# EAGLE design Bluetooth Control Car (EAGLE 9.6.2)
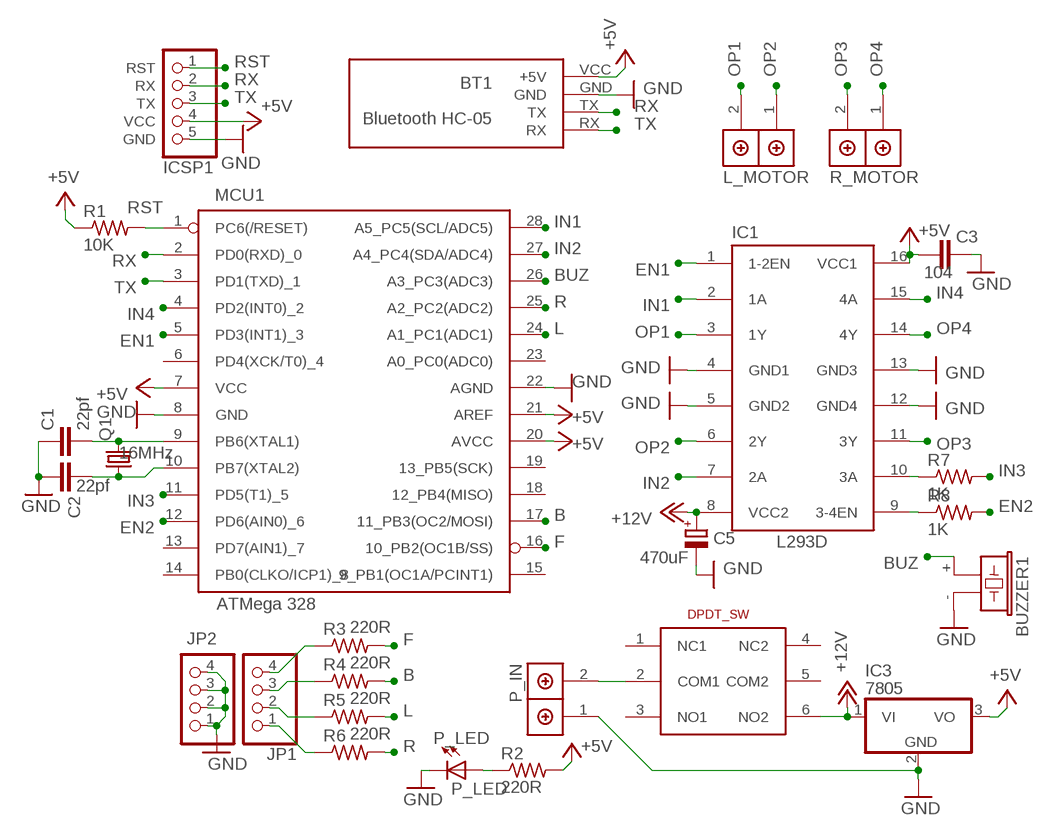
[diagram p0: schematic, sheet 1]

## Parts
BT1  Bluetooth HC-05  BLUETOOTH-HC-06-V3  [BLUETOOTH-HC-06-V3]
BUZZER1  F/CM12P  [F/CM12P]
C1  22pf  22PF  [22PF]
C2  22pf  22PF  [22PF]
C3  104  [104]
C5  470uF  CPOL-EUE5-10.5  [E5-10,5]
IC1  L293D  [DIL16]
IC3  7805  7805TV  [TO220V]
ICSP1  ICSP_ATMEGA328  [ICSP_ATMEGA]
JP1  PINHD-1X4  [1X04]
JP2  PINHD-1X4  [1X04]
L_MOTOR  2P  [2P]
MCU1  ATMega 328  ATMEGA328_P  [ATMEGA328_P]
P_IN  2P  [2P]
P_LED  P_LED  LED_3MM  [LED_3MM]
P_SW  P_SW  DPDT_SW  [6PIN_DPDT]
Q1  16MHz  CRYSTAL  [CRYSTAL]
R1  10K  RES204/7  [THR_R_204/7]
R2  220R  RES204/8  [THR_R_204/8]
R3  220R  RES204/7  [THR_R_204/7]
R4  220R  RES204/7  [THR_R_204/7]
R5  220R  RES204/7  [THR_R_204/7]
R6  220R  RES204/7  [THR_R_204/7]
R7  1K  RES204/7  [THR_R_204/7]
R8  1K  RES204/7  [THR_R_204/7]
R_MOTOR  2P  [2P]

## Nets
+5V: BT1.VCC(+5V) C3.1 IC1.16(VCC1) IC3.3(VO) ICSP1.4(VCC) MCU1.7(VCC) MCU1.20(AVCC) MCU1.21(AREF) R1.1 R2.2
+12V: C5.+ IC1.8(VCC2) IC3.1(VI) P_SW.6(NO2)
B: MCU1.17(11_PB3(OC2/MOSI)) R4.2
BUZ: BUZZER1.+ MCU1.26(A3_PC3(ADC3))
EN1: IC1.1(1-2EN) MCU1.5(PD3(INT1)_3)
EN2: MCU1.12(PD6(AIN0)_6) R8.2
F: MCU1.16(10_PB2(OC1B/SS)) R3.2
GND: BT1.GND BUZZER1.- C1.1 C2.2 C3.2 C5.- IC1.4(GND1) IC1.5(GND2) IC1.12(GND4) IC1.13(GND3) IC3.2(GND) ICSP1.5(GND) JP2.1 JP2.2 JP2.3 JP2.4 MCU1.8(GND) MCU1.22(AGND) P_IN.1(CONN1) P_LED.K
IN1: IC1.2(1A) MCU1.28(A5_PC5(SCL/ADC5))
IN2: IC1.7(2A) MCU1.27(A4_PC4(SDA/ADC4))
IN3: MCU1.11(PD5(T1)_5) R7.2
IN4: IC1.15(4A) MCU1.4(PD2(INT0)_2)
L: MCU1.24(A1_PC1(ADC1)) R5.2
N$1: C1.2 MCU1.9(PB6(XTAL1)) Q1.2
N$2: C2.1 MCU1.10(PB7(XTAL2)) Q1.1
N$3: JP1.4 R3.1
N$4: JP1.3 R4.1
N$5: P_LED.A R2.1
N$6: JP1.2 R5.1
N$7: P_IN.2(CONN2) P_SW.2(COM1)
N$8: JP1.1 R6.1
N$13: IC1.10(3A) R7.1
N$14: IC1.9(3-4EN) R8.1
OP1: IC1.3(1Y) L_MOTOR.2(CONN2)
OP2: IC1.6(2Y) L_MOTOR.1(CONN1)
OP3: IC1.11(3Y) R_MOTOR.2(CONN2)
OP4: IC1.14(4Y) R_MOTOR.1(CONN1)
R: MCU1.25(A2_PC2(ADC2)) R6.2
RST: ICSP1.1(RST) MCU1.1(PC6(/RESET)) R1.2
RX: BT1.TX ICSP1.2(RX) MCU1.2(PD0(RXD)_0)
TX: BT1.RX ICSP1.3(TX) MCU1.3(PD1(TXD)_1)
Unconnected: MCU1.6(PD4(XCK/T0)_4) MCU1.13(PD7(AIN1)_7) MCU1.14(PB0(CLKO/ICP1)_8) MCU1.15(9_PB1(OC1A/PCINT1)) MCU1.18(12_PB4(MISO)) MCU1.19(13_PB5(SCK)) MCU1.23(A0_PC0(ADC0)) P_SW.1(NC1) P_SW.3(NO1) P_SW.4(NC2) P_SW.5(COM2)

## Library data of the parts
BT1 = MHN_Modules:BLUETOOTH-HC-06-V3: Bluetooth Transceiver Module based on HC-05 board Tutorial is available here: https://arduino-info.wikispaces.com/BlueTooth-HC05-HC06-Modules-How-To Click here to find device on ebay.com <http://www.ebay.com/sch/hc-05+module+rs232>
BUZZER1 = MHN_Buzzer:F/CM12P: BUZZER Source: Buerklin; OC_FARNELL: unknown; OC_NEWARK: unknown
C1 C2 = MHN_Capacitor:22PF: (220)22pf Ceramic Capacitor
C3 = MHN_Capacitor:104: Ciramic Capacitor - 104/103/22/33 pf
C5 = rcl:CPOL-EU: POLARIZED CAPACITOR, European symbol; SPICEPREFIX: C
IC1 = st-microelectronics:L293D: PUSH-PULL 4 CHANNEL DRIVER; MPN: L293D; OC_FARNELL: 9589619; OC_NEWARK: 56P8249
IC3 = linear:78*: Positive VOLTAGE REGULATOR Source: http://cache.national.com/ds/LM/LM78L05.pdf http://www.fairchildsemi.com/ds/LM/LM7805.pdf
ICSP1 = MHN_ICSP_Header:ICSP_ATMEGA328
JP1 JP2 = pinhead:PINHD-1X4: PIN HEADER
L_MOTOR P_IN R_MOTOR = MHN_TBlock:2P: Green Terminal Block
MCU1 = MHN_IC_Microcontroller:ATMEGA328_P: Microcontroller with 32K Bytes In-System Programmable Flash
P_LED = MHN_LED:LED_3MM: LED 3mm
P_SW = MHN_Switch:DPDT_SW
Q1 = MHN_Crystal:CRYSTAL: CRYSTAL
R1-R8 = MHN_Resistor:RES

## Board
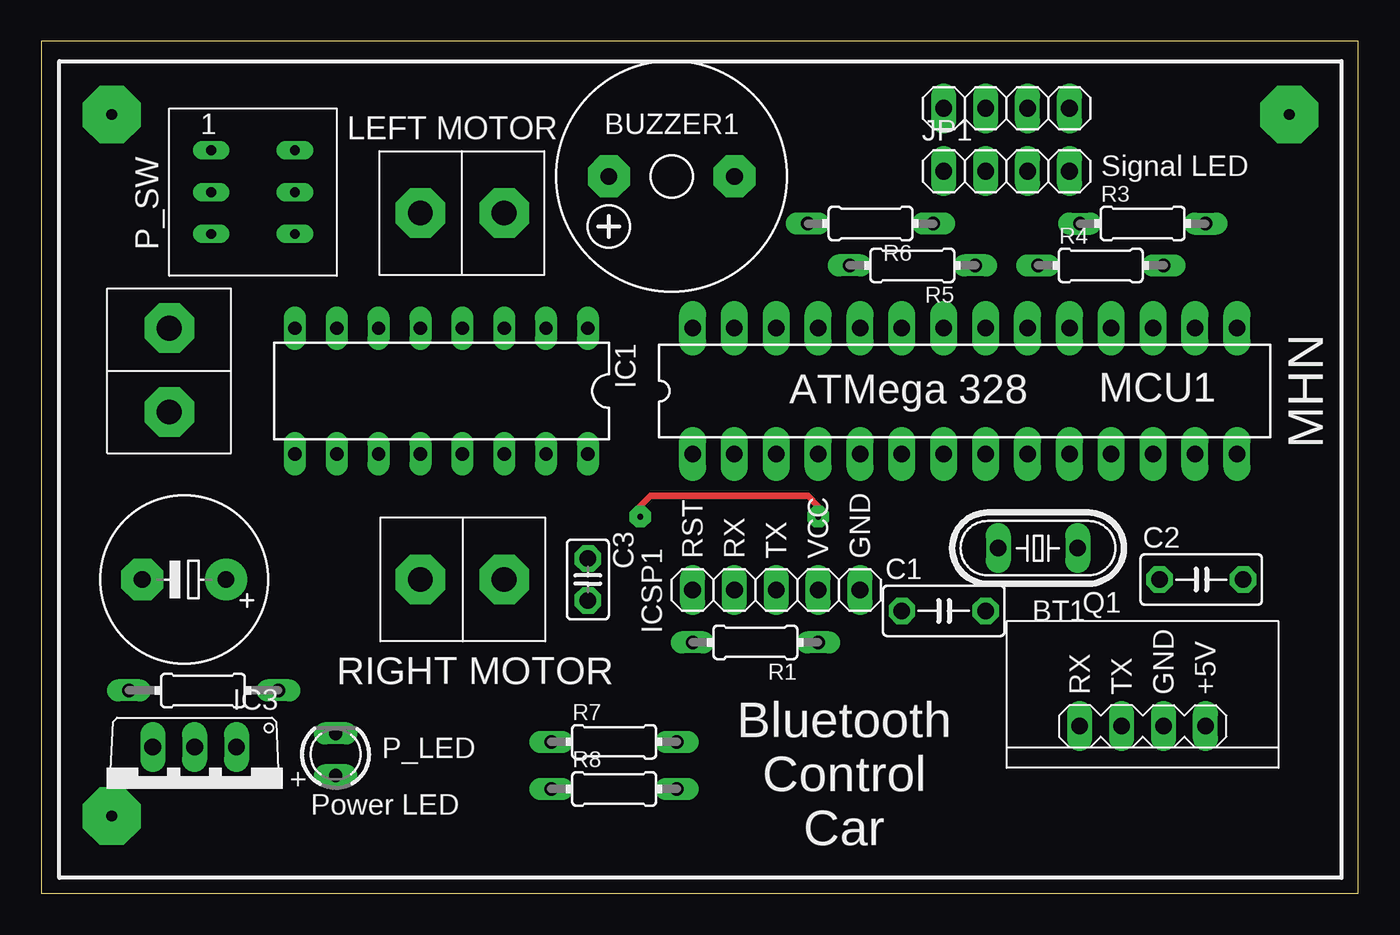
[diagram p1: board, top side]
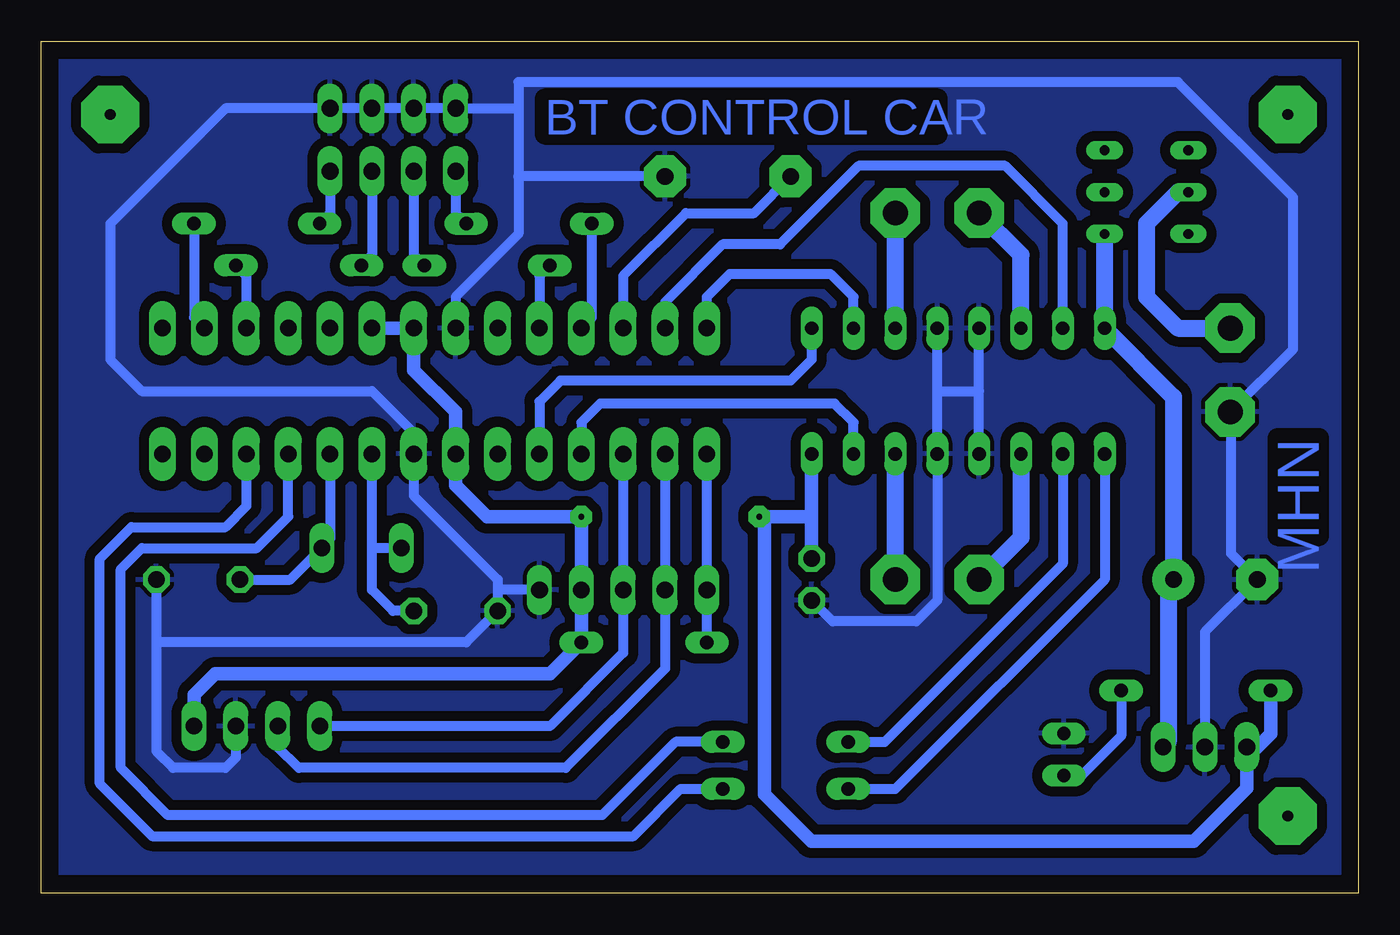
[diagram p2: board, bottom side, seen from below]

Size 79.91 x 51.68 mm. Coordinates in mm from the lower left corner, seen from the top.
Outline: 0,0 79.9,0 79.9,51.68 0,51.68 0,0
Copper layers (1*16): Top 0.035mm / dielectric 1.5mm / Bottom 0.035mm
Design rules "default": minimum track width 6mil, minimum drill 0.35mm, track to track 6mil, track to pad 6mil, pad to pad 6mil, via to via 6mil, smd to smd 6mil, copper to edge 40mil, drill to drill 6mil, minimum pad ring 10mil, minimum via ring 8mil, stop-mask expansion 4mil, vias tented up to drill 0mil, thermal gap 10mil

### Footprints (pad centres in the part's own frame; a part is rotated, then mirrored left to right if it is on the bottom)
BLUETOOTH-HC-06-V3 = drill 1 pad 1.5 long: GND 1.27,-4.445; RX -3.81,-4.445; TX -1.27,-4.445; VCC 3.81,-4.445
F/CM12P = drill 1.016 pad 2.54 octagon: + 3.81,0; - -3.81,0
22PF = drill 1 pad 1.6 octagon: 1 -2.54,0; 2 2.54,0
104 = drill 1 pad 1.6 octagon: 1 -1.27,0; 2 1.27,0
E5-10,5 = drill 1.016 pad 2.54: + -2.54,0 | drill 1.016 pad 2.54 octagon: - 2.54,0
DIL16 = drill 0.813 long: 1 -8.89,-3.81; 2 -6.35,-3.81; 3 -3.81,-3.81; 4 -1.27,-3.81; 5 1.27,-3.81; 6 3.81,-3.81; 7 6.35,-3.81; 8 8.89,-3.81; 9 8.89,3.81; 10 6.35,3.81; 11 3.81,3.81; 12 1.27,3.81; 13 -1.27,3.81; 14 -3.81,3.81; 15 -6.35,3.81; 16 -8.89,3.81
TO220V = drill 1.016 long: 1 -2.54,-2.54; 2 0,-2.54; 3 2.54,-2.54
ICSP_ATMEGA = drill 1.016 long: 1 -5.08,0; 2 -2.54,0; 3 0,0; 4 2.54,0; 5 5.08,0
1X04 = drill 1.016 long: 1 -3.81,0; 2 -1.27,0; 3 1.27,0; 4 3.81,0
2P = drill 1.5 pad 3 octagon: 1 -2.54,0; 2 2.54,0
ATMEGA328_P = drill 1 pad 1.65 long: 1 -7.62,-3.81; 2 -5.08,-3.81; 3 -2.54,-3.81; 4 0,-3.81; 5 2.54,-3.81; 6 5.08,-3.81; 7 7.62,-3.81; 8 10.16,-3.81; 9 12.7,-3.81; 10 15.24,-3.81; 11 17.78,-3.81; 12 20.32,-3.81; 13 22.86,-3.81; 14 25.4,-3.81; 15 25.4,3.81; 16 22.86,3.81; 17 20.32,3.81; 18 17.78,3.81; 19 15.24,3.81; 20 12.7,3.81; 21 10.16,3.81; 22 7.62,3.81; 23 5.08,3.81; 24 2.54,3.81; 25 0,3.81; 26 -2.54,3.81; 27 -5.08,3.81; 28 -7.62,3.81
LED_3MM = drill 0.813 long: A -1.27,0; K 1.27,0
6PIN_DPDT = drill 0.6 long: 1 -2.54,1.27; 2 -2.54,-1.27; 3 -2.54,-3.81; 4 2.54,1.27; 5 2.54,-1.27; 6 2.54,-3.81
CRYSTAL = drill 1 pad 1.5 long: 1 -2.413,0; 2 2.413,0
THR_R_204/7 = drill 0.813 long: 1 -3.81,0; 2 3.81,0
THR_R_204/8 = drill 0.813 long: 1 -3.81,0; 2 5.258,0

### Placement (x,y rotation side)
BT1  66.82,14.59 0 top
BUZZER1  38.25,43.48 180 top
C1  54.76,17.13 0 top
C2  70.38,19.04 0 top
C3  33.17,19.04 270 top
C5  8.67,19.04 180 top
IC1  24.28,30.47 180 top
IC3  9.31,6.34 180 top
ICSP1  44.6,18.4 0 top
JP1  58.57,43.8 0 top
JP2  58.57,47.61 0 top
L_MOTOR  25.55,41.26 0 top
MCU1  47.14,30.47 0 top
P_IN  7.77,31.74 90 top
P_LED  17.86,8.43 90 top
P_SW  12.85,43.8 0 top
Q1  60.47,20.94 180 top
R1  43.33,15.23 180 top
R2  10.58,12.31 180 top
R3  66.82,40.63 0 top
R4  64.28,38.09 0 top
R5  52.85,38.09 180 top
R6  50.31,40.63 180 top
R7  34.76,9.19 0 top
R8  34.76,6.34 0 top
R_MOTOR  25.55,19.04 180 top

### Tracks (layer width: path | path; a pad name or v marks a point on that pad's centre or on a via)
+5V  (via drill 0.35 pad 1.3)
  Top 0.406: v47.14,22.85 47.14,23.48 46.5,24.12 36.98,24.12 36.34,23.48 v36.34,22.85
  Bottom 0.813: BT1.VCC 70.63,12.05 69.36,13.32 49.04,13.32 R1.1 ICSP1.4 v47.14,22.85 52.85,22.85 54.76,24.75 MCU1.7 54.76,29.2 57.3,31.74 MCU1.21 MCU1.20 | IC1.16 33.17,22.85 | 33.17,22.85 C3.1 | 33.17,22.85 v36.34,22.85 36.03,22.53 36.03,6.02 33.17,3.16 9.99,3.16 6.77,6.39 IC3.3 6.13,8.88 5.32,9.69 R2.2
+12V
  Bottom 1.016: P_SW.6 IC1.8 11.21,30.1 C5.+ 11.53,18.72 11.53,9.19 IC3.1
B
  Bottom 0.61: R4.2 67.46,37.45 MCU1.17
BUZ
  Bottom 0.61: BUZZER1.+ 36.66,41.26 40.79,41.26 44.6,37.45 MCU1.26
EN1
  Bottom 0.61: IC1.1 33.17,32.37 34.44,31.1 48.41,31.1 49.68,29.83 MCU1.5
EN2
  Bottom 0.61: R8.2 41.1,6.34 43.96,3.48 73.17,3.48 76.35,6.65 76.35,20.31 74.44,22.21 68.73,22.21 67.46,23.48 MCU1.12
F
  Bottom 0.61: R3.2 70.63,34.91 MCU1.16
GND
  Bottom 0.61: 25.55,30.47 IC1.13 25.55,17.77 26.82,16.5 31.9,16.5 C3.2 | 25.55,30.47 IC1.4 | IC1.12 23.01,30.47 | 23.01,30.47 IC1.5 | 25.55,30.47 23.01,30.47 | 72.92,15.23 54.12,15.23 C1.1 52.22,18.4 | BT1.GND 68.09,8.24 68.73,7.61 71.9,7.61 72.92,8.62 C2.2 | 52.22,18.4 52.22,19.04 57.3,24.12 MCU1.8 57.3,27.93 59.84,30.47 73.81,30.47 75.71,32.37 75.71,40.63 68.73,47.61 JP2.4 JP2.3 JP2.2 JP2.1 50.95,47.61 | ICSP1.5 52.22,18.4 | MCU1.22 54.76,36.18 50.95,39.99 50.95,43.49 | 50.95,47.61 50.95,49.2 10.94,49.2 3.96,42.21 3.96,33.01 P_IN.1 7.72,29.15 7.72,20.62 C5.- 9.31,15.86 IC3.2 9.56,9.13 | 50.95,47.61 50.95,43.49 | BUZZER1.- 50.95,43.49
  pour Bottom (isolate 0.61): 78.89,1.26 78.89,50.47 1.1,50.47 1.1,1.26
IN1
  Bottom 0.61: IC1.2 30.63,36.18 32.02,37.58 38.12,37.58 39.52,36.18 MCU1.28
IN2
  Bottom 0.61: MCU1.27 42.06,35.86 38.57,39.36 35.07,39.36 30.31,44.12 21.42,44.12 17.93,40.63 IC1.7
IN3
  Bottom 0.61: MCU1.11 64.92,22.85 66.82,20.94 73.81,20.94 75.08,19.67 75.08,7.61 72.22,4.75 45.87,4.75 41.42,9.19 R7.2
IN4
  Bottom 0.61: IC1.15 30.63,28.56 31.77,29.71 45.99,29.71 47.14,28.56 MCU1.4
L
  Bottom 0.61: R5.2 49.68,37.45 MCU1.24
N$1
  Bottom 0.61: Q1.2 59.84,20.94 | 59.84,20.94 MCU1.9 | C1.2 58.57,17.13 59.84,18.4 59.84,20.94
N$2
  Bottom 0.61: C2.1 64.79,19.04 Q1.1 62.38,21.45 MCU1.10
N$3
  Bottom 0.61: JP1.4 62.38,41.26 R3.1
N$4
  Bottom 0.61: JP1.3 59.84,38.72 R4.1
N$5
  Bottom 0.61: R2.1 14.39,9.56 16.78,7.16 P_LED.A
  Bottom 0.813: R2.1 14.75,12.31
N$6
  Bottom 0.61: JP1.2 57.3,38.72 R5.1
N$7
  Bottom 1.016: P_SW.2 10.94,42.53 12.85,40.63 12.85,36.18 10.94,34.28 P_IN.2
N$8
  Bottom 0.61: JP1.1 54.76,41.26 R6.1
N$10  (via drill 0.65 pad 3.5)
  other vias: 4.27,47.23
N$11  (via drill 0.65 pad 3.5)
  other vias: 75.71,47.23
N$12  (via drill 0.65 pad 3.5)
  other vias: 4.27,4.69
N$13
  Bottom 0.61: IC1.10 17.93,19.99 28.72,9.19 R7.1
N$14
  Bottom 0.61: IC1.9 15.39,19.04 28.09,6.34 R8.1
OP1
  Bottom 1.016: IC1.3 L_MOTOR.2
OP2
  Bottom 1.016: IC1.6 20.47,38.72 L_MOTOR.1
OP3
  Bottom 1.016: IC1.11 20.47,21.58 R_MOTOR.2
OP4
  Bottom 1.016: R_MOTOR.1 IC1.14
R
  Bottom 0.61: R6.2 46.5,34.91 MCU1.25
RST
  Bottom 0.61: R1.2 ICSP1.1 MCU1.1
RX
  Bottom 0.61: MCU1.2 ICSP1.2 42.06,13.64 48.09,7.61 64.28,7.61 65.55,8.88 BT1.TX
TX
  Bottom 0.61: MCU1.3 ICSP1.3 44.6,14.59 49.04,10.15 BT1.RX

### Text on the board
Bottom: BT CONTROL CAR | MHN
tPlace: LEFT MOTOR | Signal LED | MHN | RIGHT MOTOR | Bluetooth / Control / Car | Power LED